# Altium project RFID_DACS-01.PrjPcb (part 2 of 3)

## Sheet 3.RFID.SchDoc: RFID
size A3; DrawnBy: AYTAC DILEK; SheetNumber: 3; SheetTotal: 16
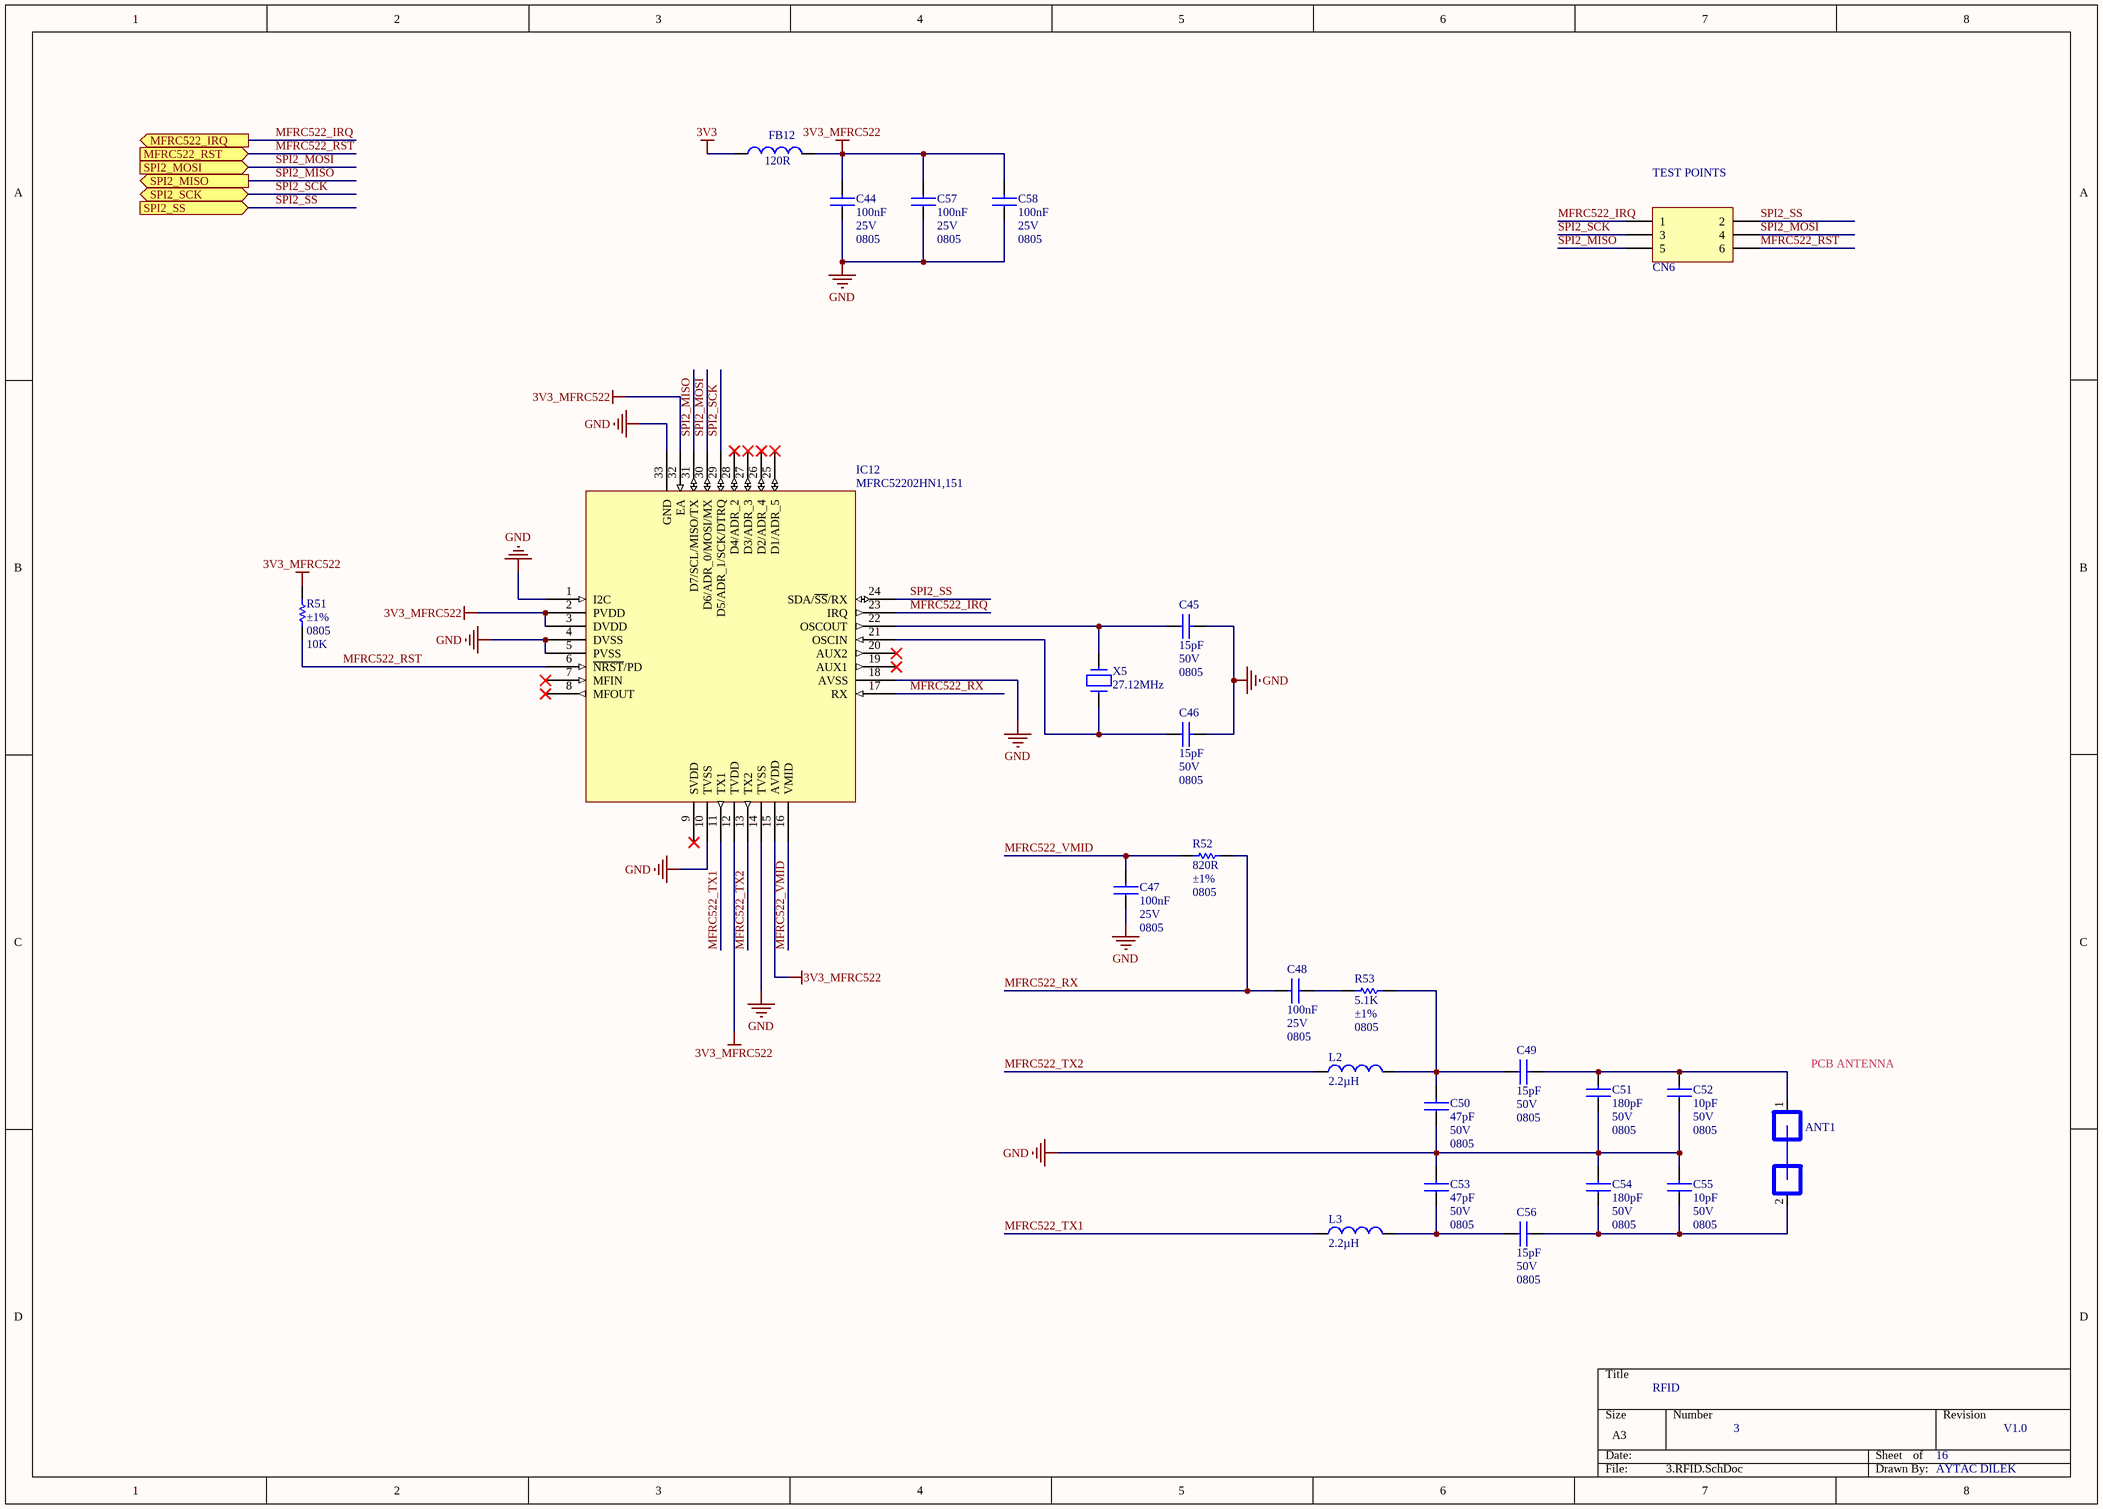
[diagram p3: 3.RFID.SchDoc]

### Parts
ANT1  COIL_ANTENNA_PAD  [COIL_ANTENNA_PAD]  (value not drawn)
C44  Capacitance: 100nF  Voltage - Rated: 25V  Package / Case: 0805  [CAPC2012X100N_EIA0805]  (hidden comment: CAP_NP)
C45  Capacitance: 15pF  Voltage - Rated: 50V  Package / Case: 0805  [CAPC2012X100N_EIA0805]  (hidden comment: CAP_NP)
C46  Capacitance: 15pF  Voltage - Rated: 50V  Package / Case: 0805  [CAPC2012X100N_EIA0805]  (hidden comment: CAP_NP)
C47  Capacitance: 100nF  Voltage - Rated: 25V  Package / Case: 0805  [CAPC2012X100N_EIA0805]  (hidden comment: CAP_NP)
C48  Capacitance: 100nF  Voltage - Rated: 25V  Package / Case: 0805  [CAPC2012X100N_EIA0805]  (hidden comment: CAP_NP)
C49  Capacitance: 15pF  Voltage - Rated: 50V  Package / Case: 0805  [CAPC2012X100N_EIA0805]  (hidden comment: CAP_NP)
C50  Capacitance: 47pF  Voltage - Rated: 50V  Package / Case: 0805  [CAPC2012X100N_EIA0805]  (hidden comment: CAP_NP)
C51  Capacitance: 180pF  Voltage - Rated: 50V  Package / Case: 0805  [CAPC2012X100N_EIA0805]  (hidden comment: CAP_NP)
C52  Capacitance: 10pF  Voltage - Rated: 50V  Package / Case: 0805  [CAPC2012X100N_EIA0805]  (hidden comment: CAP_NP)
C53  Capacitance: 47pF  Voltage - Rated: 50V  Package / Case: 0805  [CAPC2012X100N_EIA0805]  (hidden comment: CAP_NP)
C54  Capacitance: 180pF  Voltage - Rated: 50V  Package / Case: 0805  [CAPC2012X100N_EIA0805]  (hidden comment: CAP_NP)
C55  Capacitance: 10pF  Voltage - Rated: 50V  Package / Case: 0805  [CAPC2012X100N_EIA0805]  (hidden comment: CAP_NP)
C56  Capacitance: 15pF  Voltage - Rated: 50V  Package / Case: 0805  [CAPC2012X100N_EIA0805]  (hidden comment: CAP_NP)
C57  Capacitance: 100nF  Voltage - Rated: 25V  Package / Case: 0805  [CAPC2012X100N_EIA0805]  (hidden comment: CAP_NP)
C58  Capacitance: 100nF  Voltage - Rated: 25V  Package / Case: 0805  [CAPC2012X100N_EIA0805]  (hidden comment: CAP_NP)
CN6  HDR_2X3  [HDRV6W64P254_2X3_762X508X600P]  (value not drawn)
FB12  Impedance: 120R  [FILC2012X100N_EIA0805]  (hidden comment: BEAD)
IC12  Manufacturer Part Number: MFRC52202HN1,151  [QFN50P500X500X100_HS-33N_[NXP]SOT617-1]  (hidden comment: MFRC522)
L2  Inductance: 2.2µH  [INDC2115X13N_EIA0805]  (hidden comment: INDUCTOR)
L3  Inductance: 2.2µH  [INDC2115X13N_EIA0805]  (hidden comment: INDUCTOR)
R51  Tolerance: ±1%  Package / Case: 0805  Resistance (Ohm): 10K  [RESC2013X65N_EIA0805]  (hidden comment: RES)
R52  value 820R  Tolerance: ±1%  Package / Case: 0805  [RESC2013X65N_EIA0805]  (hidden comment: RES)
R53  value 5.1K  Tolerance: ±1%  Package / Case: 0805  [RESC2013X65N_EIA0805]  (hidden comment: RES)
X5  value 27.12MHz  [HC-49/US]  (hidden comment: CRYSTAL)

### Ports
MFRC522_IRQ (out), MFRC522_RST (in), SPI2_MISO (out), SPI2_MOSI (in), SPI2_SCK (bidir), SPI2_SS (in)

### Nets
3V3: FB12.1
3V3_MFRC522: C44.2 C57.2 C58.2 FB12.2 IC12.2(PVDD) IC12.3(DVDD) IC12.12(TVDD) IC12.15(AVDD) IC12.32(EA) R51.1
GND: C44.1 C45.2 C46.2 C47.1 C50.1 C51.1 C52.1 C53.2 C54.2 C55.2 C57.1 C58.1 IC12.1(I2C) IC12.4(DVSS) IC12.5(PVSS) IC12.10(TVSS) IC12.14(TVSS) IC12.18(AVSS) IC12.33(GND)
MFRC522_IRQ: CN6.1 IC12.23(IRQ) ; port MFRC522_IRQ
MFRC522_RST: CN6.6 IC12.6(~{NRST}/PD) R51.2 ; port MFRC522_RST
MFRC522_RX: C48.2 IC12.17(RX) R52.1
MFRC522_TX1: IC12.11(TX1) L3.1
MFRC522_TX2: IC12.13(TX2) L2.1
MFRC522_VMID: C47.2 IC12.16(VMID) R52.2
SPI2_MISO: CN6.5 IC12.31(D7/SCL/MISO/TX) ; port SPI2_MISO
SPI2_MOSI: CN6.4 IC12.30(D6/ADR_0/MOSI/MX) ; port SPI2_MOSI
SPI2_SCK: CN6.3 IC12.29(D5/ADR_1/SCK/DTRQ) ; port SPI2_SCK
SPI2_SS: CN6.2 IC12.24(SDA/~{SS}/RX) ; port SPI2_SS
NetANT1_1: ANT1.1 C49.2 C51.2 C52.2
NetANT1_2: ANT1.2 C54.1 C55.1 C56.2
NetC45_1: C45.1 IC12.22(OSCOUT) X5.1
NetC46_1: C46.1 IC12.21(OSCIN) X5.2
NetC48_1: C48.1 R53.2
NetC49_1: C49.1 C50.2 L2.2 R53.1
NetC53_1: C53.1 C56.1 L3.2

Not connected (* = marked no-connect by the designer): IC12 7(MFIN)* 8(MFOUT)* 9(SVDD)* 19(AUX1)* 20(AUX2)* 25(D1/ADR_5)* 26(D2/ADR_4)* 27(D3/ADR_3)* 28(D4/ADR_2)*

### Notes on the sheet
- (near CN6) TEST POINTS
- PCB ANTENNA

### Library data of the parts
ANT1 = SMSC00008: Coil Antenna Pad; Part Number: SMSC00008; Value: COIL_ANTENNA_PAD
C44 C47 C48 C57 C58 = SCAP00300093: CAP CER 0.1UF 25V X7R 0805; Manufacturer: Samsung Electro-Mechanics America, Inc.; Manufacturer Part Number: CL21B104KACNNNC; Value: 100nF; Tolerance: ±10%; Type: Multi Layer Ceramic Capacitor  (MLCC); Cost x1 ($): 0.10000; Cost x10 ($): 0.03300; Cost x100 ($): 0.01470; Cost x1000 ($): 0.00825; Distrubutor: Digikey; Lead Time: 11 Weeks; Part Number: SCAP00300093; Temperature Coefficient: X7R; Operating Temperature: -55°C ~ 125°C; Mounting Type: Surface Mount, MLCC; Size / Dimension: 0.079" L x 0.049" W (2.00mm x 1.25mm); Category: Capacitors; Family: Ceramic Capacitors; Distributor Part Number: 1276-1099-1-ND; Distributor Link: http://www.digikey.com/product-detail/en/samsung-electro-mechanics-america-inc/CL21B104KACNNNC/1276-1099-1-ND/3889185; ROHS: YES; Moisture Sensitivity Level (MSL): 1 (Unlimited); Quantity: 50
C45 C46 C49 C56 = SCAP00300038: CAP CER 15PF 50V NP0 0805; Manufacturer: Samsung Electro-Mechanics America, Inc.; Manufacturer Part Number: CL21C150JB61PNC; Tolerance: ±5%; Temperature Coefficient: C0G, NP0; Type: Multi Layer Ceramic Capacitor  (MLCC); Cost x1 ($): 0.10000; Cost x10 ($): 0.05100; Cost x100 ($): 0.02250; Cost x1000 ($): 0.01265; Distrubutor: Digikey; Lead Time: 11 Weeks; Part Number: SCAP00300038; Value: 15pF; Operating Temperature: -55°C ~ 125°C; Mounting Type: Surface Mount, MLCC; Size / Dimension: 0.079" L x 0.049" W (2.00mm x 1.25mm); Category: Capacitors; Family: Ceramic Capacitors; Distributor Part Number: 1276-2585-1-ND; Distributor Link: http://www.digikey.com/product-detail/en/samsung-electro-mechanics-america-inc/CL21C150JB61PNC/1276-2585-1-ND/3890671; ROHS: YES; Moisture Sensitivity Level (MSL): 1 (Unlimited); Quantity: 50
C50 C53 = SCAP00300050: CAP CER 47PF 50V NP0 0805; Manufacturer: Samsung Electro-Mechanics America, Inc.; Manufacturer Part Number: CL21C470JBANNNC; Tolerance: ±5%; Temperature Coefficient: C0G, NP0; Type: Multi Layer Ceramic Capacitor  (MLCC); Cost x1 ($): 0.10000; Cost x10 ($): 0.04400; Cost x100 ($): 0.01960; Cost x1000 ($): 0.01100; Distrubutor: Digikey; Lead Time: 14 Weeks; Part Number: SCAP00300050; Value: 47pF; Operating Temperature: -55°C ~ 125°C; Mounting Type: Surface Mount, MLCC; Size / Dimension: 0.079" L x 0.049" W (2.00mm x 1.25mm); Category: Capacitors; Family: Ceramic Capacitors; Distributor Part Number: 1276-1156-1-ND; Distributor Link: http://www.digikey.com/product-detail/en/samsung-electro-mechanics-america-inc/CL21C470JBANNNC/1276-1156-1-ND/3889242; ROHS: YES; Moisture Sensitivity Level (MSL): 1 (Unlimited); Quantity: 50
C51 C54 = SCAP00300064: CAP CER 180PF 50V NP0 0805; Manufacturer: Samsung Electro-Mechanics America, Inc.; Manufacturer Part Number: CL21C181JBANNNC; Tolerance: ±5%; Temperature Coefficient: C0G, NP0; Type: Multi Layer Ceramic Capacitor  (MLCC); Cost x1 ($): 0.10000; Cost x10 ($): 0.05800; Cost x100 ($): 0.02570; Cost x1000 ($): 0.01444; Distrubutor: Digikey; Lead Time: 11 Weeks; Part Number: SCAP00300064; Value: 180pF; Operating Temperature: -55°C ~ 125°C; Mounting Type: Surface Mount, MLCC; Size / Dimension: 0.079" L x 0.049" W (2.00mm x 1.25mm); Category: Capacitors; Family: Ceramic Capacitors; Distributor Part Number: 1276-1129-1-ND; Distributor Link: http://www.digikey.com/product-detail/en/samsung-electro-mechanics-america-inc/CL21C181JBANNNC/1276-1129-1-ND/3889215; ROHS: YES; Moisture Sensitivity Level (MSL): 1 (Unlimited); Quantity: 50
C52 C55 = SCAP00300034: CAP CER 10PF 50V NP0 0805; Manufacturer: Samsung Electro-Mechanics America, Inc.; Manufacturer Part Number: CL21C100CBANNNC; Tolerance: ±0.25pF; Temperature Coefficient: C0G, NP0; Type: Multi Layer Ceramic Capacitor  (MLCC); Cost x1 ($): 0.10000; Cost x10 ($): 0.08000; Cost x100 ($): 0.03760; Cost x1000 ($): 0.02182; Distrubutor: Digikey; Lead Time: 11 Weeks; Part Number: SCAP00300034; Value: 10pF; Operating Temperature: -55°C ~ 125°C; Mounting Type: Surface Mount, MLCC; Size / Dimension: 0.079" L x 0.049" W (2.00mm x 1.25mm); Category: Capacitors; Family: Ceramic Capacitors; Distributor Part Number: 1276-2561-1-ND; Distributor Link: http://www.digikey.com/product-detail/en/samsung-electro-mechanics-america-inc/CL21C100CBANNNC/1276-2561-1-ND/3890647; ROHS: YES; Moisture Sensitivity Level (MSL): 1 (Unlimited); Quantity: 50
CN6 = SCON00128: CONN HEADER FMALE 6PS .1" DL TIN; Manufacturer: Sullins Connector Solutions; Manufacturer Part Number: PPTC032LFBN-RC; Pitch: 2.54mm; Cost x1 ($): 0.80000; Cost x10 ($): 0.62200; Cost x100 ($): 0.47480; Cost x1000 ($): 0.33760; Distrubutor: Digikey; Part Number: SCON00128; Value: HDR_2X3; Category: Connectors, Interconnects; Family: Rectangular Connectors - Headers, Receptacles, Female Sockets; Connector Type: Header; Contact Type: Female Socket; Mounting Type: Through Hole; Distributor Part Number: S7071-ND; Datasheet Link: http://www.digikey.com/product-detail/en/sullins-connector-solutions/PPTC032LFBN-RC/S7071-ND/810210; ROHS: YES; Quantity: 0
FB12 = SFIL00005: FERRITE CHIP POWER 120 OHM SMD; Manufacturer: Laird-Signal Integrity Products; Manufacturer Part Number: HI0805O121R-10; Type: Differential Mode - Single; Current Rating: 3.5A; DC Resistance (DCR): 20 mOhm Max; Cost x10 ($): 0.08700; Cost x100 ($): 0.05230; Cost x1000 ($): 0.03010; Distrubutor: Digikey; Cost x1 ($): 0.10000; Part Number: SFIL00005; Package / Case: 0805 (2012 Metric); Value: BEAD; Category: Filters; Family: Ferrite Beads and Chips; Distributor Part Number: 240-2393-1-ND; ROHS: YES; Datasheet Link: http://www.digikey.com/product-detail/en/HI0805O121R-10/240-2393-1-ND/806753; Quantity: 50
IC12 = SRF000006: IC READER 13.56MHZ 32-HVQFN; Manufacturer: NXP Semiconductors; Voltage - Supply: 2.5 V ~ 3.3 V; Cost x10 ($): 4.37500; Cost x100 ($): 3.58750; Cost x1000 ($): 2.45000; Distrubutor: Digikey; Lead Time: 8 Weeks; Revision Status: OK; Revision By: Aytac Dilek; Cost x1 ($): 4.90000; Part Number: SRF000006; Value: MFRC522; Operating Temperature: -25°C ~ 85°C; Category: RF/IF and RFID; Family: RFID, RF Access, Monitoring Ics; Package / Case: 32-HVQFN (5x5); Type: RFID Reader; Distributor Part Number: 568-8603-ND; ROHS: YES; Part Status: Active; Datasheet Link: http://www.digikey.com/product-detail/en/nxp-semiconductors/MFRC52202HN1,151/568-8603-ND/2606239; Moisture Sensitivity Level (MSL): 1 (Unlimited); Quantity: 0; Revision Date: 09/17/2016
L2 L3 = SIND00007: FIXED IND 2.2UH 1.3A 80 MOHM SMD; Manufacturer: Murata Electronics North America; Manufacturer Part Number: LQM2HPN2R2MG0L; Tolerance: ±20%; DC Resistance (DCR): 100 mOhm Max; Type: Multilayer; Cost x10 ($): 0.30700; Cost x100 ($): 0.22170; Cost x1000 ($): 0.15686; Distrubutor: Digikey; Lead Time: 8 Weeks; Cost x1 ($): 0.34000; Part Number: SIND00007; Value: 2.2uH; Package / Case: 0805 (2012 Metric); Operating Temperature: -55°C ~ 125°C; Current Rating: 1.3A; Category: Inductors, Coils, Chokes; Family: Fixed Inductors; Distributor Part Number: 490-5114-1-ND; Distributor Link: http://www.digikey.com/product-detail/en/murata-electronics-north-america/LQM2HPN2R2MG0L/490-5114-1-ND/1893677; ROHS: YES; Moisture Sensitivity Level (MSL): 1 (Unlimited); Quantity: 100
R51 = SRES03010098: RES SMD 10K OHM 1% 1/8W 0805; Manufacturer: Yageo; Manufacturer Part Number: RC0805FR-0710KL; Power (Watts): 0.125W, 1/8W; Cost x1 ($): 0.10; Cost x10 ($): 0.21; Cost x100 ($): 0.84; Cost x1000 ($): 3.79; Distrubutor: Digikey; Part Number: SRES03010098; Value: 10K; Category: Resistors; Family: Chip Resistor - Surface Mount; Distributor Part Number: 311-10.0KCRCT-ND; Distributor Link: http://www.digikey.com/product-detail/en/RC0805FR-0710KL/311-10.0KCRCT-ND/730482; ROHS: YES; Quantity: 0
R52 = SRES03010072: RES SMD 820 OHM 1% 1/8W 0805; Manufacturer: Yageo; Manufacturer Part Number: RC0805FR-07820RL; Resistance (Ohm): 820; Power (Watts): 0.125W, 1/8W; Cost x1 ($): 0.10; Cost x10 ($): 0.21; Cost x100 ($): 0.84; Cost x1000 ($): 3.79; Distrubutor: Digikey; Part Number: SRES03010072; Category: Resistors; Family: Chip Resistor - Surface Mount; Distributor Part Number: 311-820CRCT-ND; Distributor Link: http://www.digikey.com/product-detail/en/RC0805FR-07820RL/311-820CRCT-ND/731115; ROHS: YES; Quantity: 0
R53 = SRES03010091: RES SMD 5.1K OHM 1% 1/8W 0805; Manufacturer: Yageo; Manufacturer Part Number: RC0805FR-075K1L; Power (Watts): 0.125W, 1/8W; Cost x1 ($): 0.10; Cost x10 ($): 0.21; Cost x100 ($): 0.84; Cost x1000 ($): 3.79; Distrubutor: Digikey; Part Number: SRES03010091; Resistance (Ohm): 5.1K; Category: Resistors; Family: Chip Resistor - Surface Mount; Distributor Part Number: 311-5.10KCRCT-ND; Distributor Link: http://www.digikey.com/product-detail/en/RC0805FR-075K1L/311-5.10KCRCT-ND/730935; ROHS: YES; Quantity: 0
X5 = SCRY00017: CRYSTAL 27.1200MHZ 18PF SMD; Manufacturer: IQD; Manufacturer Part Number: LFXTAL057488Bulk; Frequency Tolerance: ±20ppm; Load Capacitance: 20pF; ESR: 40 Ohm; Cost x10 ($): 0.538; Cost x100 ($): 0.445; Cost x1000 ($): 0.351; Distrubutor: Mouser; Lead Time: 7 Weeks; Cost x1 ($): 0.604; Part Number: SCRY00017; Mounting Type: Through Hole; Package / Case: HC49/US; Type: MHz Crystal; Distributor Part Number: 449-LFXTAL057488BULK; ROHS: YES; Datasheet Link: http://eu.mouser.com/ProductDetail/IQD/LFXTAL057488Bulk/?qs=sGAEpiMZZMsBj6bBr9Q9aR%2fuGiDjvlIShMBIAlFQovQfY2Fj9uCXUA%3d%3d; Quantity: 50

## Sheet 11.MICROSD.SchDoc: MICRO-SD
size A; SheetNumber: 11; SheetTotal: 16
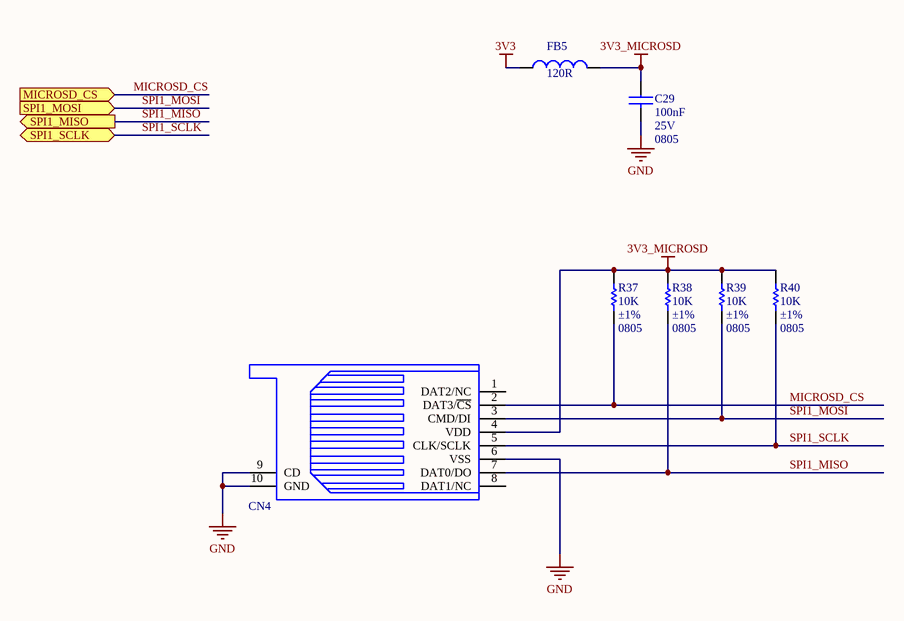
[diagram p4: 11.MICROSD.SchDoc]

### Parts
C29  Capacitance: 100nF  Voltage - Rated: 25V  Package / Case: 0805  [CAPC2012X100N_EIA0805]  (hidden comment: CAP_NP)
CN4  MICRO-SD  [MOLEX_0472192001]  (value not drawn)
FB5  Impedance: 120R  [FILC2012X100N_EIA0805]  (hidden comment: BEAD)
R37  value 10K  Tolerance: ±1%  Package / Case: 0805  [RESC2013X65N_EIA0805]  (hidden comment: RES)
R38  value 10K  Tolerance: ±1%  Package / Case: 0805  [RESC2013X65N_EIA0805]  (hidden comment: RES)
R39  value 10K  Tolerance: ±1%  Package / Case: 0805  [RESC2013X65N_EIA0805]  (hidden comment: RES)
R40  value 10K  Tolerance: ±1%  Package / Case: 0805  [RESC2013X65N_EIA0805]  (hidden comment: RES)

### Ports
MICROSD_CS (in), SPI1_MISO (out), SPI1_MOSI (in), SPI1_SCLK (bidir)

### Nets
3V3: FB5.1
3V3_MICROSD: C29.1 CN4.4(VDD) FB5.2 R37.1 R38.1 R39.1 R40.1
GND: C29.2 CN4.6(VSS) CN4.9(CD) CN4.10(GND)
MICROSD_CS: CN4.2(DAT3/~{CS}) R37.2 ; port MICROSD_CS
SPI1_MISO: CN4.7(DAT0/DO) R38.2 ; port SPI1_MISO
SPI1_MOSI: CN4.3(CMD/DI) R39.2 ; port SPI1_MOSI
SPI1_SCLK: CN4.5(CLK/SCLK) R40.2 ; port SPI1_SCLK

Not connected (* = marked no-connect by the designer): CN4 1(DAT2/NC) 8(DAT1/NC)

### Library data of the parts
C29 = SCAP00300093: as C44 on sheet 3.RFID; Part Number: SCAP00300093; Temperature Coefficient: X7R; Operating Temperature: -55°C ~ 125°C; Mounting Type: Surface Mount, MLCC; Size / Dimension: 0.079" L x 0.049" W (2.00mm x 1.25mm); Category: Capacitors; Family: Ceramic Capacitors; Distributor Part Number: 1276-1099-1-ND; Distributor Link: http://www.digikey.com/product-detail/en/samsung-electro-mechanics-america-inc/CL21B104KACNNNC/1276-1099-1-ND/3889185; ROHS: YES; Moisture Sensitivity Level (MSL): 1 (Unlimited); Quantity: 50
CN4 = SCON00095: CONN MICRO SD CARD HINGED TYPE; Manufacturer: Molex, LLC; Manufacturer Part Number: 0472192001; Connector Type: Connector and Ejector; Cost x1 ($): 1.11000; Cost x10 ($): 0.97300; Cost x100 ($): 0.83950; Cost x1000 ($): 0.76320; Distrubutor: Digikey; Lead Time: 10 Weeks; Part Number: SCON00095; Value: MICRO-SD; Category: Connectors, Interconnects; Family: Memory Connectors - PC Cards - Secure Digital - microSD™; Contact Type: Secure Digital - microSD™; Mounting Type: Normal, Standard - Top; Distributor Part Number: WM6698CT-ND; Datasheet Link: http://www.digikey.com/product-detail/en/0472192001/WM6698CT-ND/3044147; ROHS: YES; Moisture Sensitivity Level (MSL): 1 (Unlimited); Part Status: Active; Quantity: 20
FB5 = SFIL00005: as FB12 on sheet 3.RFID; Part Number: SFIL00005; Package / Case: 0805 (2012 Metric); Value: BEAD; Category: Filters; Family: Ferrite Beads and Chips; Distributor Part Number: 240-2393-1-ND; ROHS: YES; Datasheet Link: http://www.digikey.com/product-detail/en/HI0805O121R-10/240-2393-1-ND/806753; Quantity: 50
R37-R40 = SRES03010098: as R51 on sheet 3.RFID; Part Number: SRES03010098; Resistance (Ohm): 10K; Category: Resistors; Family: Chip Resistor - Surface Mount; Distributor Part Number: 311-10.0KCRCT-ND; Distributor Link: http://www.digikey.com/product-detail/en/RC0805FR-0710KL/311-10.0KCRCT-ND/730482; ROHS: YES; Quantity: 0

## Sheet 12.SPI_FLASH.SchDoc: SPI FLASH
size A; SheetNumber: 12; SheetTotal: 16
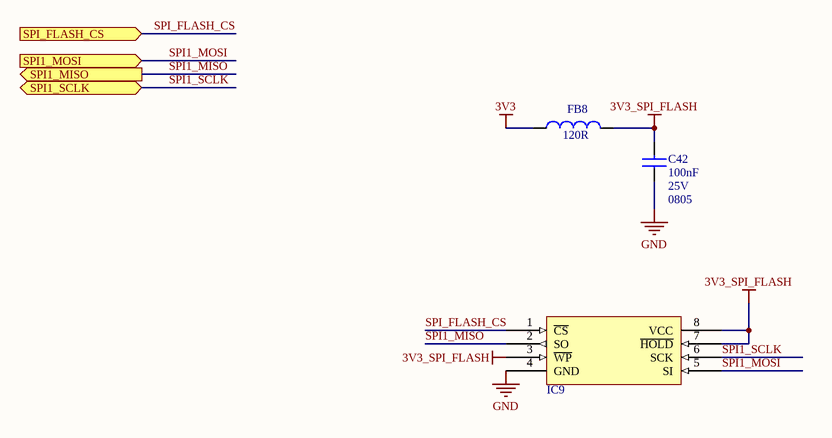
[diagram p5: 12.SPI_FLASH.SchDoc]

### Parts
C42  Capacitance: 100nF  Voltage - Rated: 25V  Package / Case: 0805  [CAPC2012X100N_EIA0805]  (hidden comment: CAP_NP)
FB8  Impedance: 120R  [FILC2012X100N_EIA0805]  (hidden comment: BEAD)
IC9  W25Q16  [SOIC127P780X216-8N]  (value not drawn)

### Ports
SPI1_MISO (out), SPI1_MOSI (in), SPI1_SCLK (bidir), SPI_FLASH_CS (in)

### Nets
3V3: FB8.1
3V3_SPI_FLASH: C42.2 FB8.2 IC9.3(~{WP}) IC9.7(~{HOLD}) IC9.8(VCC)
GND: C42.1 IC9.4(GND)
SPI1_MISO: IC9.2(SO) ; port SPI1_MISO
SPI1_MOSI: IC9.5(SI) ; port SPI1_MOSI
SPI1_SCLK: IC9.6(SCK) ; port SPI1_SCLK
SPI_FLASH_CS: IC9.1(~{CS}) ; port SPI_FLASH_CS

### Library data of the parts
C42 = SCAP00300093: as C44 on sheet 3.RFID; Part Number: SCAP00300093; Temperature Coefficient: X7R; Operating Temperature: -55°C ~ 125°C; Mounting Type: Surface Mount, MLCC; Size / Dimension: 0.079" L x 0.049" W (2.00mm x 1.25mm); Category: Capacitors; Family: Ceramic Capacitors; Distributor Part Number: 1276-1099-1-ND; Distributor Link: http://www.digikey.com/product-detail/en/samsung-electro-mechanics-america-inc/CL21B104KACNNNC/1276-1099-1-ND/3889185; ROHS: YES; Moisture Sensitivity Level (MSL): 1 (Unlimited); Quantity: 50
FB8 = SFIL00005: as FB12 on sheet 3.RFID; Part Number: SFIL00005; Package / Case: 0805 (2012 Metric); Value: BEAD; Category: Filters; Family: Ferrite Beads and Chips; Distributor Part Number: 240-2393-1-ND; ROHS: YES; Datasheet Link: http://www.digikey.com/product-detail/en/HI0805O121R-10/240-2393-1-ND/806753; Quantity: 50
IC9 = SMEM00015: IC FLASH 16MBIT 104MHZ 8SOIC; Manufacturer: Winbond Electronics; Manufacturer Part Number: W25Q16DVSSIG; Value: W25Q16DVSIG; Voltage: 2.7 V ~ 3.6 V; Memory Type: FLASH - NOR; Memory Size: 16M (2M x 8); Interface: SPI Serial; Cost x10 ($): 0.43900; Cost x100 ($): 0.40533; Cost x1000 ($): 0.34068; Distrubutor: Digikey; Lead Time: 14 Weeks; Cost x1 ($): 0.45000; Part Number: SMEM00015; Package: SMD; Operating Temperature: -40°C ~ 85°C (TA); Category: Integrated Circuits (ICs); Family: Memory; Speed: 104MHz; Package / Case: 8-SOIC (0.209", 5.30mm Width); Format - Memory: FLASH; Distributor Part Number: W25Q16DVSSIG-ND; Distributor Link: http://www.digikey.com/product-detail/en/winbond-electronics/W25Q16DVSSIG/W25Q16DVSSIG-ND/4037437; ROHS: YES; MSL: 3 (168 Hours); Quantity: 5

## Sheet 6.CLCD.SchDoc: CHARACTER LCD
size A; SheetNumber: 6; SheetTotal: 16
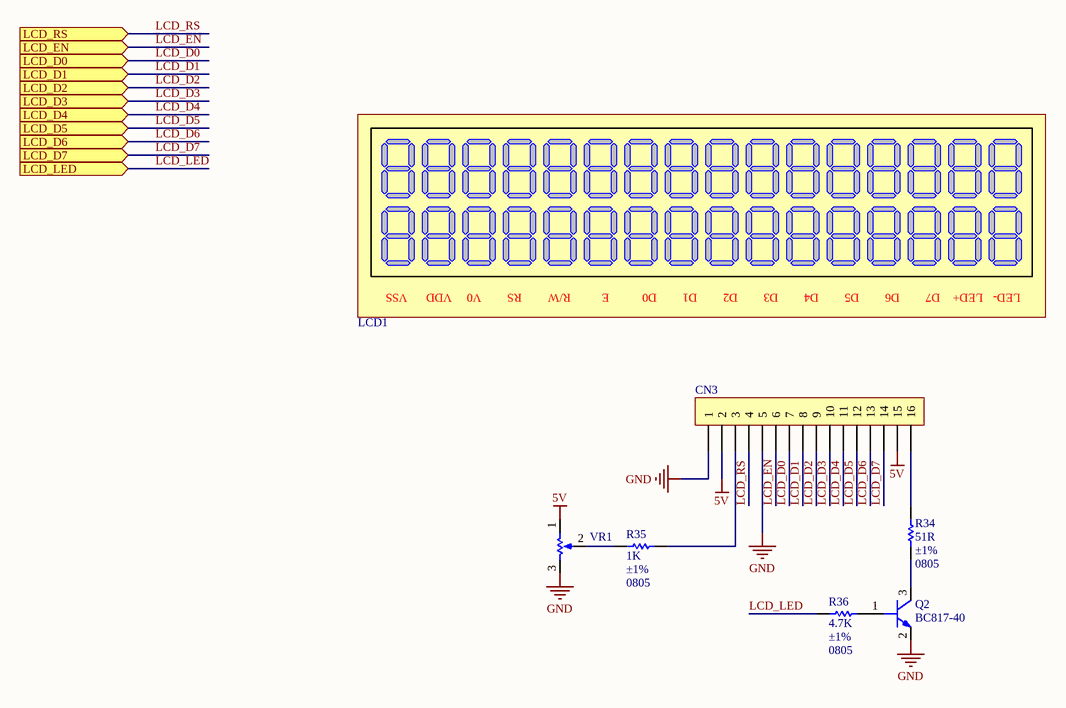
[diagram p6: 6.CLCD.SchDoc]

### Parts
CN3  HDR_1X16  [HDRFV16W70P254_1X16_4064X254X1118P]  (value not drawn)
LCD1  HD44780  [HD44780]  (value not drawn)
Q2  value BC817-40  [SOT95P230X110-3N_SOT-23]  (hidden comment: BC817)
R34  value 51R  Tolerance: ±1%  Package / Case: 0805  [RESC2013X65N_EIA0805]  (hidden comment: RES)
R35  value 1K  Tolerance: ±1%  Package / Case: 0805  [RESC2013X65N_EIA0805]  (hidden comment: RES)
R36  value 4.7K  Tolerance: ±1%  Package / Case: 0805  [RESC2013X65N_EIA0805]  (hidden comment: RES)
VR1  POT  [TRIMMER_SMD]  (value not drawn)

### Ports
LCD_D0 (in), LCD_D1 (in), LCD_D2 (in), LCD_D3 (in), LCD_D4 (in), LCD_D5 (in), LCD_D6 (in), LCD_D7 (in), LCD_EN (in), LCD_LED (in), LCD_RS (in)

### Nets
5V: CN3.2 CN3.15 VR1.1(TOP)
GND: CN3.1 CN3.5 Q2.2(E) VR1.3(BOT)
LCD_D0: CN3.7 ; port LCD_D0
LCD_D1: CN3.8 ; port LCD_D1
LCD_D2: CN3.9 ; port LCD_D2
LCD_D3: CN3.10 ; port LCD_D3
LCD_D4: CN3.11 ; port LCD_D4
LCD_D5: CN3.12 ; port LCD_D5
LCD_D6: CN3.13 ; port LCD_D6
LCD_D7: CN3.14 ; port LCD_D7
LCD_EN: CN3.6 ; port LCD_EN
LCD_LED: R36.2 ; port LCD_LED
LCD_RS: CN3.4 ; port LCD_RS
NetCN3_3: CN3.3 R35.1
NetCN3_16: CN3.16 R34.1
NetQ2_1: Q2.1(B) R36.1
NetQ2_3: Q2.3(C) R34.2
NetR35_2: R35.2 VR1.2(TAP)

### Notes on the sheet
- (in symbol SOPT00201) VSS; VDD; V0; RS; R/W; E; D0; D1; D2; D3; D4; D5; D6; D7; LED+; LED-

### Library data of the parts
CN3 = SCON00136: CONN HEADER FEMALE 16POS.1" TIN; Manufacturer: Sullins Connector Solutions; Manufacturer Part Number: PPTC161LFBN-RC; Pitch: 2.54mm; Cost x1 ($): 1.22000; Cost x10 ($): 1.01500; Cost x100 ($): 0.75200; Cost x1000 ($): 0.54520; Distrubutor: Digikey; Lead Time: 3 Weeks; Part Number: SCON00136; Value: HDR_1X16; Category: Connectors, Interconnects; Family: Rectangular Connectors - Headers, Receptacles, Female Sockets; Connector Type: Header; Contact Type: Female Socket; Mounting Type: Through Hole; Contact Finish: Tin; Distributor Part Number: S7014-ND; Datasheet Link: http://www.digikey.com/product-detail/en/sullins-connector-solutions/PPTC161LFBN-RC/S7014-ND/810154; ROHS: YES; Moisture Sensitivity Level (MSL): 1 (Unlimited); Part Status: Active; Quantity: 0
LCD1 = SOPT00201: LCD MODULE 16X2 CHARACTER; Manufacturer: AV-DISPLAY; Manufacturer Part Number: HY-1602F; Value: 1602_CHAR_LCD; Voltage: 5V; Cost x1 ($): $4.00; Part Number: SOPT00201; Category: Optoelectronics; Family: Display Modules - LCD, OLED Character and Numeric; Type: STN - Super-Twisted Nematic; ROHS: YES; Quantity: 3
Q2 = STRANS00034: TRANS NPN 45V 0.5A SOT23; Manufacturer: NXP Semiconductors; Manufacturer Part Number: BC817-40,215; Ic (Max): 500mA; Vce Saturation (Max) @ Ib, Ic: 700mV @ 50mA, 500mA; Ic Cutoff (Max): 100nA (ICBO); hFE (Min) @ Ic, Vce: 250 @ 100mA, 1V; Power - Max: 250mW; Frequency - Transition: 100MHz; Cost x10 ($): 0.12700; Cost x100 ($): 0.06930; Cost x1000 ($): 0.02905; Distrubutor: Digikey; Lead Time: 6 Weeks; Cost x1 ($): 0.14000; Part Number: STRANS00034; Vce Breakdown (Max): 45V; Mounting Type: SMD; Category: Discrete Semiconductor Products; Family: Transistors (BJT) - Single; Transistor Type: NPN; Package / Case: SOT-23-3, TO-236-3, SC-59; Distributor Part Number: 568-1631-1-ND; ROHS: YES; Datasheet Link: http://www.digikey.com/product-detail/en/nxp-semiconductors/BC817-40,215/568-1631-1-ND/763458; Quantity: 110
R34 = SRES03010043: RES SMD 51 OHM 1% 1/8W 0805; Manufacturer: Yageo; Manufacturer Part Number: RC0805FR-0751RL; Resistance (Ohm): 51; Power (Watts): 0.125W, 1/8W; Cost x1 ($): 0.10; Cost x10 ($): 0.21; Cost x100 ($): 0.84; Cost x1000 ($): 3.79; Distrubutor: Digikey; Part Number: SRES03010043; Category: Resistors; Family: Chip Resistor - Surface Mount; Distributor Part Number: 311-51.0CRCT-ND; Distributor Link: http://www.digikey.com/product-detail/en/RC0805FR-0751RL/311-51.0CRCT-ND/730959; ROHS: YES; Quantity: 0
R35 = SRES03010074: RES SMD 1K OHM 1% 1/8W 0805; Manufacturer: Yageo; Manufacturer Part Number: RC0805FR-071KL; Power (Watts): 0.125W, 1/8W; Cost x1 ($): 0.10; Cost x10 ($): 0.21; Cost x100 ($): 0.84; Cost x1000 ($): 3.79; Distrubutor: Digikey; Part Number: SRES03010074; Resistance (Ohm): 1K; Category: Resistors; Family: Chip Resistor - Surface Mount; Distributor Part Number: 311-1.00KCRCT-ND; Distributor Link: http://www.digikey.com/product-detail/en/RC0805FR-071KL/311-1.00KCRCT-ND/730391; ROHS: YES; Quantity: 0
R36 = SRES03010090: RES SMD 4.7K OHM 1% 1/8W 0805; Manufacturer: Yageo; Manufacturer Part Number: RC0805FR-074K7L; Power (Watts): 0.125W, 1/8W; Cost x1 ($): 0.10; Cost x10 ($): 0.21; Cost x100 ($): 0.84; Cost x1000 ($): 3.79; Distrubutor: Digikey; Part Number: SRES03010090; Resistance (Ohm): 4.7K; Category: Resistors; Family: Chip Resistor - Surface Mount; Distributor Part Number: 311-4.70KCRCT-ND; Distributor Link: http://www.digikey.com/product-detail/en/RC0805FR-074K7L/311-4.70KCRCT-ND/730876; ROHS: YES; Quantity: 0
VR1 = SPOT00047: TRIMMER 10K OHM 0.15W SMD; Manufacturer: Panasonic Electronic Components; Manufacturer Part Number: EVM-3YSX50B14; Tolerance: ±25%; Cost x10 ($): 0.33000; Cost x100 ($): 0.27200; Cost x1000 ($): 0.18426; Distrubutor: Digikey; Lead Time: 11 Weeks; Part Number: SPOT00047; Value: TRIMMER10K; Category: Potentiometers, Variable Resistors; Resistance (Ohms): 10k; Power (Watts): 0.15W; Package: SMD; Family: Trimmer Potentiometers; Type: Top Adjustment; Distributor Part Number: P3Y103CT-ND; ROHS: YES; Datasheet Link: http://www.digikey.com/product-detail/en/EVM-3YSX50B14/P3Y103CT-ND/259859; Quantity: 10; Cost x1 ($): 0.33000

## Sheet 7.EEPROM.SchDoc: EEPROM
size A; SheetNumber: 7; SheetTotal: 16
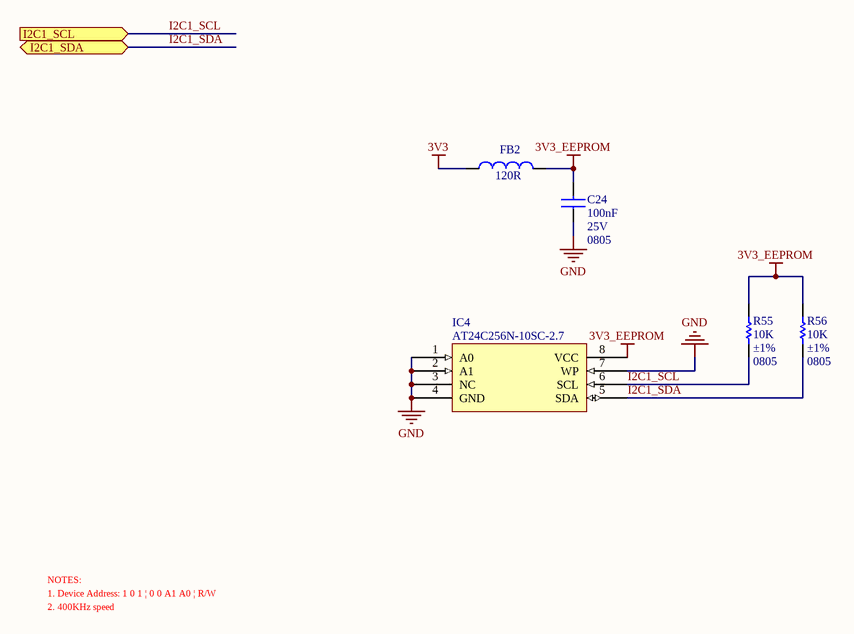
[diagram p7: 7.EEPROM.SchDoc]

### Parts
C24  Capacitance: 100nF  Voltage - Rated: 25V  Package / Case: 0805  [CAPC2012X100N_EIA0805]  (hidden comment: CAP_NP)
FB2  Impedance: 120R  [FILC2012X100N_EIA0805]  (hidden comment: BEAD)
IC4  Manufacturer Part Number: AT24C256N-10SC-2.7  [SOIC127P600X175-8N]  (hidden comment: AT24C256)
R55  Resistance (Ohm): 10K  Tolerance: ±1%  Package / Case: 0805  [RESC2013X65N_EIA0805]  (hidden comment: RES)
R56  Resistance (Ohm): 10K  Tolerance: ±1%  Package / Case: 0805  [RESC2013X65N_EIA0805]  (hidden comment: RES)

### Ports
I2C1_SCL (in), I2C1_SDA (bidir)

### Nets
3V3: FB2.1
3V3_EEPROM: C24.2 FB2.2 IC4.8(VCC) R55.1 R56.1
GND: C24.1 IC4.1(A0) IC4.2(A1) IC4.3(NC) IC4.4(GND) IC4.7(WP)
I2C1_SCL: IC4.6(SCL) R55.2 ; port I2C1_SCL
I2C1_SDA: IC4.5(SDA) R56.2 ; port I2C1_SDA

### Notes on the sheet
- NOTES:
- 1. Device Address: 1 0 1 | 0 0 A1 A0 | R/W
- 2. 400KHz speed

### Library data of the parts
C24 = SCAP00300093: as C44 on sheet 3.RFID; Part Number: SCAP00300093; Temperature Coefficient: X7R; Operating Temperature: -55°C ~ 125°C; Mounting Type: Surface Mount, MLCC; Size / Dimension: 0.079" L x 0.049" W (2.00mm x 1.25mm); Category: Capacitors; Family: Ceramic Capacitors; Distributor Part Number: 1276-1099-1-ND; Distributor Link: http://www.digikey.com/product-detail/en/samsung-electro-mechanics-america-inc/CL21B104KACNNNC/1276-1099-1-ND/3889185; ROHS: YES; Moisture Sensitivity Level (MSL): 1 (Unlimited); Quantity: 50
FB2 = SFIL00005: as FB12 on sheet 3.RFID; Part Number: SFIL00005; Package / Case: 0805 (2012 Metric); Value: BEAD; Category: Filters; Family: Ferrite Beads and Chips; Distributor Part Number: 240-2393-1-ND; ROHS: YES; Datasheet Link: http://www.digikey.com/product-detail/en/HI0805O121R-10/240-2393-1-ND/806753; Quantity: 50
IC4 = SMEM00019: IC EEPROM 256KBIT 1MHZ 8SOIC; Manufacturer: Atmel; Voltage: 2.7 V ~ 5.5 V; Memory Size: 256K (32K x 8); Speed: 400kHz, 1MHz; Interface: I²C, 2-Wire Serial; Format - Memory: EEPROMs - Serial; Cost x10 ($): 0.55000; Cost x100 ($): 0.48290; Cost x1000 ($): 0.45477; Distrubutor: Digikey; Cost x1 ($): 0.60000; Part Number: SMEM00019; Value: AT24C256; Package: SMD; Operating Temperature: 0°C ~ 70°C (TA); Category: Integrated Circuits (ICs); Family: Memory; Memory Type: EEPROM; Package / Case: 8-SOIC (0.154", 3.90mm Width); Distributor Part Number: AT24C256N-10SC2.7-ND; Distributor Link: http://www.digikey.com/product-detail/en/atmel/AT24C256N-10SC-2.7/AT24C256N-10SC2.7-ND/398095; ROHS: YES; MSL: 1 (Unlimited); Quantity: 20
R55 R56 = SRES03010098: as R51 on sheet 3.RFID; Part Number: SRES03010098; Value: 10K; Category: Resistors; Family: Chip Resistor - Surface Mount; Distributor Part Number: 311-10.0KCRCT-ND; Distributor Link: http://www.digikey.com/product-detail/en/RC0805FR-0710KL/311-10.0KCRCT-ND/730482; ROHS: YES; Quantity: 0

## Sheet 8.RTC.SchDoc: RTC
size A; SheetNumber: 8; SheetTotal: 16
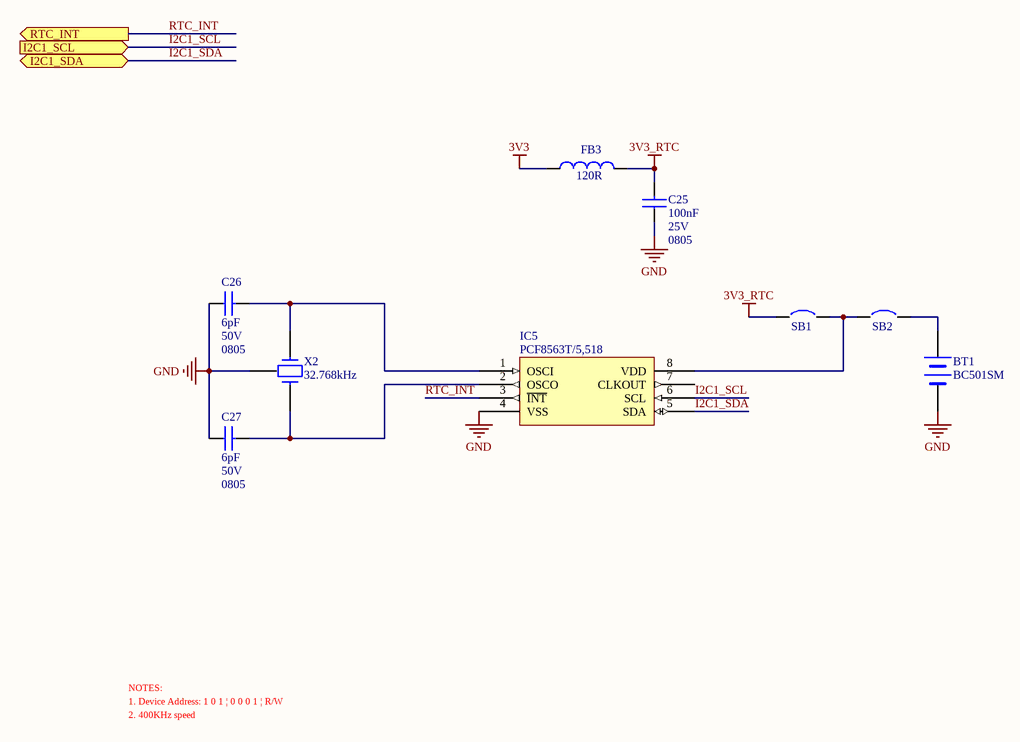
[diagram p8: 8.RTC.SchDoc]

### Parts
BT1  value BC501SM  [MPD_BC501SM]  (hidden comment: BATTERY)
C25  Capacitance: 100nF  Voltage - Rated: 25V  Package / Case: 0805  [CAPC2012X100N_EIA0805]  (hidden comment: CAP_NP)
C26  Capacitance: 6pF  Voltage - Rated: 50V  Package / Case: 0805  [CAPC2012X100N_EIA0805]  (hidden comment: CAP_NP)
C27  Capacitance: 6pF  Voltage - Rated: 50V  Package / Case: 0805  [CAPC2012X100N_EIA0805]  (hidden comment: CAP_NP)
FB3  Impedance: 120R  [FILC2012X100N_EIA0805]  (hidden comment: BEAD)
IC5  Manufacturer Part Number: PCF8563T/5,518  [SOIC127P600X175-8N]  (hidden comment: PC58563)
SB1  SOLDER_BRIDGE  [SOLDER_BRIDGE_0805]  (value not drawn)
SB2  SOLDER_BRIDGE  [SOLDER_BRIDGE_0805]  (value not drawn)
X2  value 32.768kHz  [32.768_DIP]  (hidden comment: CRYSTAL_32K)

### Ports
I2C1_SCL (in), I2C1_SDA (bidir), RTC_INT (out)

### Nets
3V3: FB3.1
3V3_RTC: C25.2 FB3.2 SB1.1
GND: BT1.2(-) C25.1 C26.1 C27.1 IC5.4(VSS) X2.3
I2C1_SCL: IC5.6(SCL) ; port I2C1_SCL
I2C1_SDA: IC5.5(SDA) ; port I2C1_SDA
RTC_INT: IC5.3(~{INT}) ; port RTC_INT
NetBT1_1: BT1.1(+) SB2.2
NetC26_2: C26.2 IC5.1(OSCI) X2.2
NetC27_2: C27.2 IC5.2(OSCO) X2.1
NetIC5_8: IC5.8(VDD) SB1.2 SB2.1

Not connected (* = marked no-connect by the designer): IC5 7(CLKOUT)

### Notes on the sheet
- NOTES:
- 1. Device Address: 1 0 1 | 0 0 0 1 | R/W
- 2. 400KHz speed

### Library data of the parts
BT1 = SBAT00011: HOLDER COIN CELL FOR CR1220 SMD; Manufacturer: MPD (Memory Protection Devices); Voltage: 3V; Battery Chemistry: Coin Cell, Holder; Battery Cell Size: Coin, 12.0mm; Cost x10 ($): 0.81000; Cost x100 ($): 0.73000; Cost x1000 ($): 0.59000; Distrubutor: Digikey; Lead Time: 12 Weeks; Cost x1 ($): 0.88000; Part Number: SBAT00011; Mounting Type: PCB, Surface Mount; Category: Battery Products; Family: Battery Holders, Clips, Contacts; Manufacturer Part Number: BC501SM; Distributor Part Number: BC501SM-ND; ROHS: YES; Distributor Link: http://www.digikey.com/product-detail/en/mpd-memory-protection-devices/BC501SM/BC501SM-ND/2439260; Quantity: 20
C25 = SCAP00300093: as C44 on sheet 3.RFID; Part Number: SCAP00300093; Temperature Coefficient: X7R; Operating Temperature: -55°C ~ 125°C; Mounting Type: Surface Mount, MLCC; Size / Dimension: 0.079" L x 0.049" W (2.00mm x 1.25mm); Category: Capacitors; Family: Ceramic Capacitors; Distributor Part Number: 1276-1099-1-ND; Distributor Link: http://www.digikey.com/product-detail/en/samsung-electro-mechanics-america-inc/CL21B104KACNNNC/1276-1099-1-ND/3889185; ROHS: YES; Moisture Sensitivity Level (MSL): 1 (Unlimited); Quantity: 50
C26 C27 = SCAP00300025: CAP CER 6PF 50V NP0 0805; Manufacturer: Samsung Electro-Mechanics America, Inc.; Manufacturer Part Number: CL21C060CBANNNC; Tolerance: ±0.25pF; Temperature Coefficient: C0G, NP0; Type: Multi Layer Ceramic Capacitor  (MLCC); Cost x1 ($): 0.10000; Cost x10 ($): 0.01900; Cost x100 ($): 0.00860; Cost x1000 ($): 0.00481; Distrubutor: Digikey; Lead Time: 11 Weeks; Part Number: SCAP00300025; Value: 6pF; Operating Temperature: -55°C ~ 125°C; Mounting Type: Surface Mount, MLCC; Size / Dimension: 0.079" L x 0.049" W (2.00mm x 1.25mm); Category: Capacitors; Family: Ceramic Capacitors; Distributor Part Number: 1276-1767-1-ND; Distributor Link: http://www.digikey.com/product-detail/en/samsung-electro-mechanics-america-inc/CL21C060CBANNNC/1276-1767-1-ND/3889853; ROHS: YES; Moisture Sensitivity Level (MSL): 1 (Unlimited); Quantity: 50
FB3 = SFIL00005: as FB12 on sheet 3.RFID; Part Number: SFIL00005; Package / Case: 0805 (2012 Metric); Value: BEAD; Category: Filters; Family: Ferrite Beads and Chips; Distributor Part Number: 240-2393-1-ND; ROHS: YES; Datasheet Link: http://www.digikey.com/product-detail/en/HI0805O121R-10/240-2393-1-ND/806753; Quantity: 50
IC5 = SIC00132: IC RTC CLK/CALENDAR I2C 8-SOIC; Manufacturer: NXP Semiconductors; Value: PCF8563; Vin: 1.8 V ~ 5.5 V; Protocol: I²C, 2-Wire Serial; Iin: 0.6µA ~ 0.75µA @ 2V ~ 5V; Cost x10 ($): 0.74300; Cost x100 ($): 0.56810; Cost x1000 ($): 0.36053; Distrubutor: Digikey; Lead Time: 7 Weeks; Cost x1 ($): 0.85000; Part Number: SIC00132; Operating Temperature: -40°C ~ 85°C; Category: Integrated Circuits (ICs); Family: Clock/Timing - Real Time Clocks; Package / Case: 8-SOIC (0.154", 3.90mm Width); Type: Clock/Calendar; Distributor Part Number: 568-6650-1-ND; ROHS: YES; Distributor Link: http://www.digikey.com/product-detail/en/nxp-semiconductors/PCF8563T-5,518/568-6650-1-ND/2617089; MSL: 2 (1 Year); Quantity: 10
SB1 SB2 = SMSC00006: SOLDER BRIDGE 0805; Part Number: SMSC00006; Value: SOLDER_BRIDGE
X2 = SCRY00009: CRYSTAL 32.768KHZ 6PF THRU; Manufacturer: Seiko Instruments; Manufacturer Part Number: VT200F-6PF20PPM; Frequency Tolerance: ±20ppm; ESR: 50 kOhm; Cost x10 ($): 0.25000; Cost x100 ($): 0.20000; Cost x1000 ($): 0.16000; Distrubutor: Digikey; Lead Time: 11 Weeks; Cost x1 ($): 0.30000; Part Number: SCRY00009; Mounting Type: Through Hole; Load Capacitance: 6pF; Package / Case: Cylindrical Can, Radial; Type: kHz Crystal (Tuning Fork); Distributor Part Number: 728-1000-ND; ROHS: YES; Datasheet Link: http://www.digikey.com/product-detail/en/VT200F-6PF20PPM/728-1000-ND/1626715; Quantity: 10

## Sheet 9.TEMP.SchDoc: TEMPERATURE AND HUMIDITY SENSOR
size A; SheetNumber: 9; SheetTotal: 16
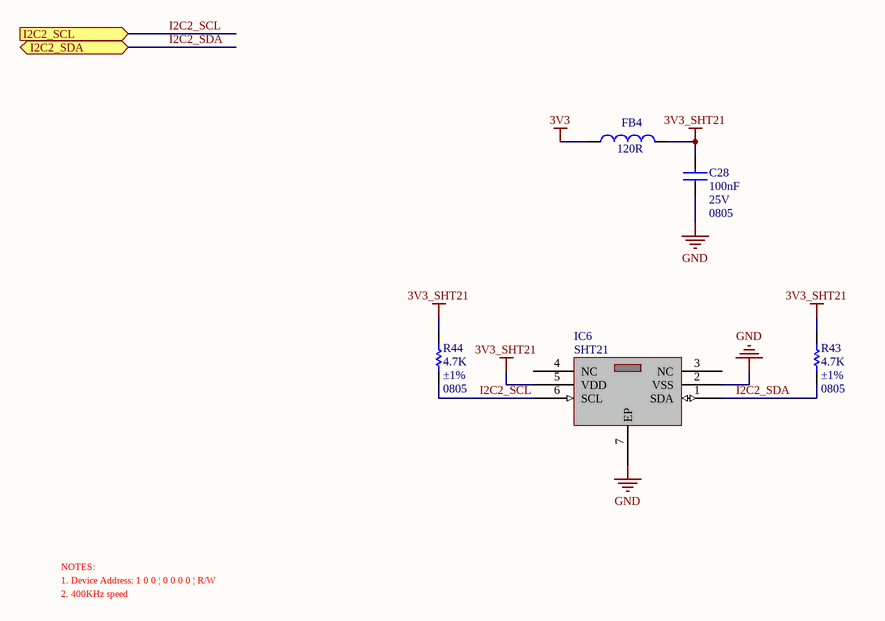
[diagram p9: 9.TEMP.SchDoc]

### Parts
C28  Capacitance: 100nF  Voltage - Rated: 25V  Package / Case: 0805  [CAPC2012X100N_EIA0805]  (hidden comment: CAP_NP)
FB4  Impedance: 120R  [FILC2012X100N_EIA0805]  (hidden comment: BEAD)
IC6  SHT21  [SHT21]
R43  Resistance (Ohm): 4.7K  Tolerance: ±1%  Package / Case: 0805  [RESC2013X65N_EIA0805]  (hidden comment: RES)
R44  Resistance (Ohm): 4.7K  Tolerance: ±1%  Package / Case: 0805  [RESC2013X65N_EIA0805]  (hidden comment: RES)

### Ports
I2C2_SCL (in), I2C2_SDA (bidir)

### Nets
3V3: FB4.1
3V3_SHT21: C28.2 FB4.2 IC6.5(VDD) R43.2 R44.2
GND: C28.1 IC6.2(VSS) IC6.7(EP)
I2C2_SCL: IC6.6(SCL) R44.1 ; port I2C2_SCL
I2C2_SDA: IC6.1(SDA) R43.1 ; port I2C2_SDA

Not connected (* = marked no-connect by the designer): IC6 3(NC) 4(NC)

### Notes on the sheet
- NOTES:
- 1. Device Address: 1 0 0 | 0 0 0 0 | R/W
- 2. 400KHz speed

### Library data of the parts
C28 = SCAP00300093: as C44 on sheet 3.RFID; Part Number: SCAP00300093; Temperature Coefficient: X7R; Operating Temperature: -55°C ~ 125°C; Mounting Type: Surface Mount, MLCC; Size / Dimension: 0.079" L x 0.049" W (2.00mm x 1.25mm); Category: Capacitors; Family: Ceramic Capacitors; Distributor Part Number: 1276-1099-1-ND; Distributor Link: http://www.digikey.com/product-detail/en/samsung-electro-mechanics-america-inc/CL21B104KACNNNC/1276-1099-1-ND/3889185; ROHS: YES; Moisture Sensitivity Level (MSL): 1 (Unlimited); Quantity: 50
FB4 = SFIL00005: as FB12 on sheet 3.RFID; Part Number: SFIL00005; Package / Case: 0805 (2012 Metric); Value: BEAD; Category: Filters; Family: Ferrite Beads and Chips; Distributor Part Number: 240-2393-1-ND; ROHS: YES; Datasheet Link: http://www.digikey.com/product-detail/en/HI0805O121R-10/240-2393-1-ND/806753; Quantity: 50
IC6 = SSEN00014: HUMIDITY AND TEMPERATURE SENSOR; Manufacturer: Sensirion AG; Voltage: 2.1 V ~ 3.6 V; Output Type: I²C; Sensor Type: Humidity, Temperature; Cost x10($): 7.07900; Cost x100 ($): 5.03360; Distrubutor: DigiKey; Lead Time: 4 Weeks; Cost x1 ($): 8.97000; Part Number: SSEN00014; Value: SHT21; Operating Temperature: -40°C ~ 125°C; Category: Sensors, Transducers; Family: Moisture Sensors, Humidity; Cost x1000 ($): 5.03360; Manufacturer Part Number: SHT21; Distributor Part Number: 1649-1005-1-ND; ROHS: YES; Distributor Link: http://www.digikey.com/product-detail/en/sensirion-ag/SHT21/1649-1005-1-ND/5872287; MSL: 1 (Unlimited); Quantity: 0
R43 R44 = SRES03010090: as R36 on sheet 6.CLCD; Part Number: SRES03010090; Value: 4.7K; Category: Resistors; Family: Chip Resistor - Surface Mount; Distributor Part Number: 311-4.70KCRCT-ND; Distributor Link: http://www.digikey.com/product-detail/en/RC0805FR-074K7L/311-4.70KCRCT-ND/730876; ROHS: YES; Quantity: 0